# Altium project DIOT_temperature_logger.PrjPCB (part 2 of 6)

## Sheet MCU_STM32F4.SchDoc: Thermostat 8CH
size 420 x 297 mm; Author: G.K.; CompanyName: WUT; DrawnBy: G.K.; Organization: WUT ISE; Address1: Warsaw Univeristy of Technology; Address2: Nowowiejska 15/19; DocumentNumber: 3; Revision: -; SheetNumber: 3; SheetTotal: 8; EDA_Number: Sinara; Projet: Thermostat; ModifiedBy: -; CreateDate: XX/XX/XXXX; CheckedDate: -; Title2: STM32 CPU; DivGrp: ISE; Designer: G.K.; ModifiedDate: -; ProjectName: Booster RF Power Amplifier
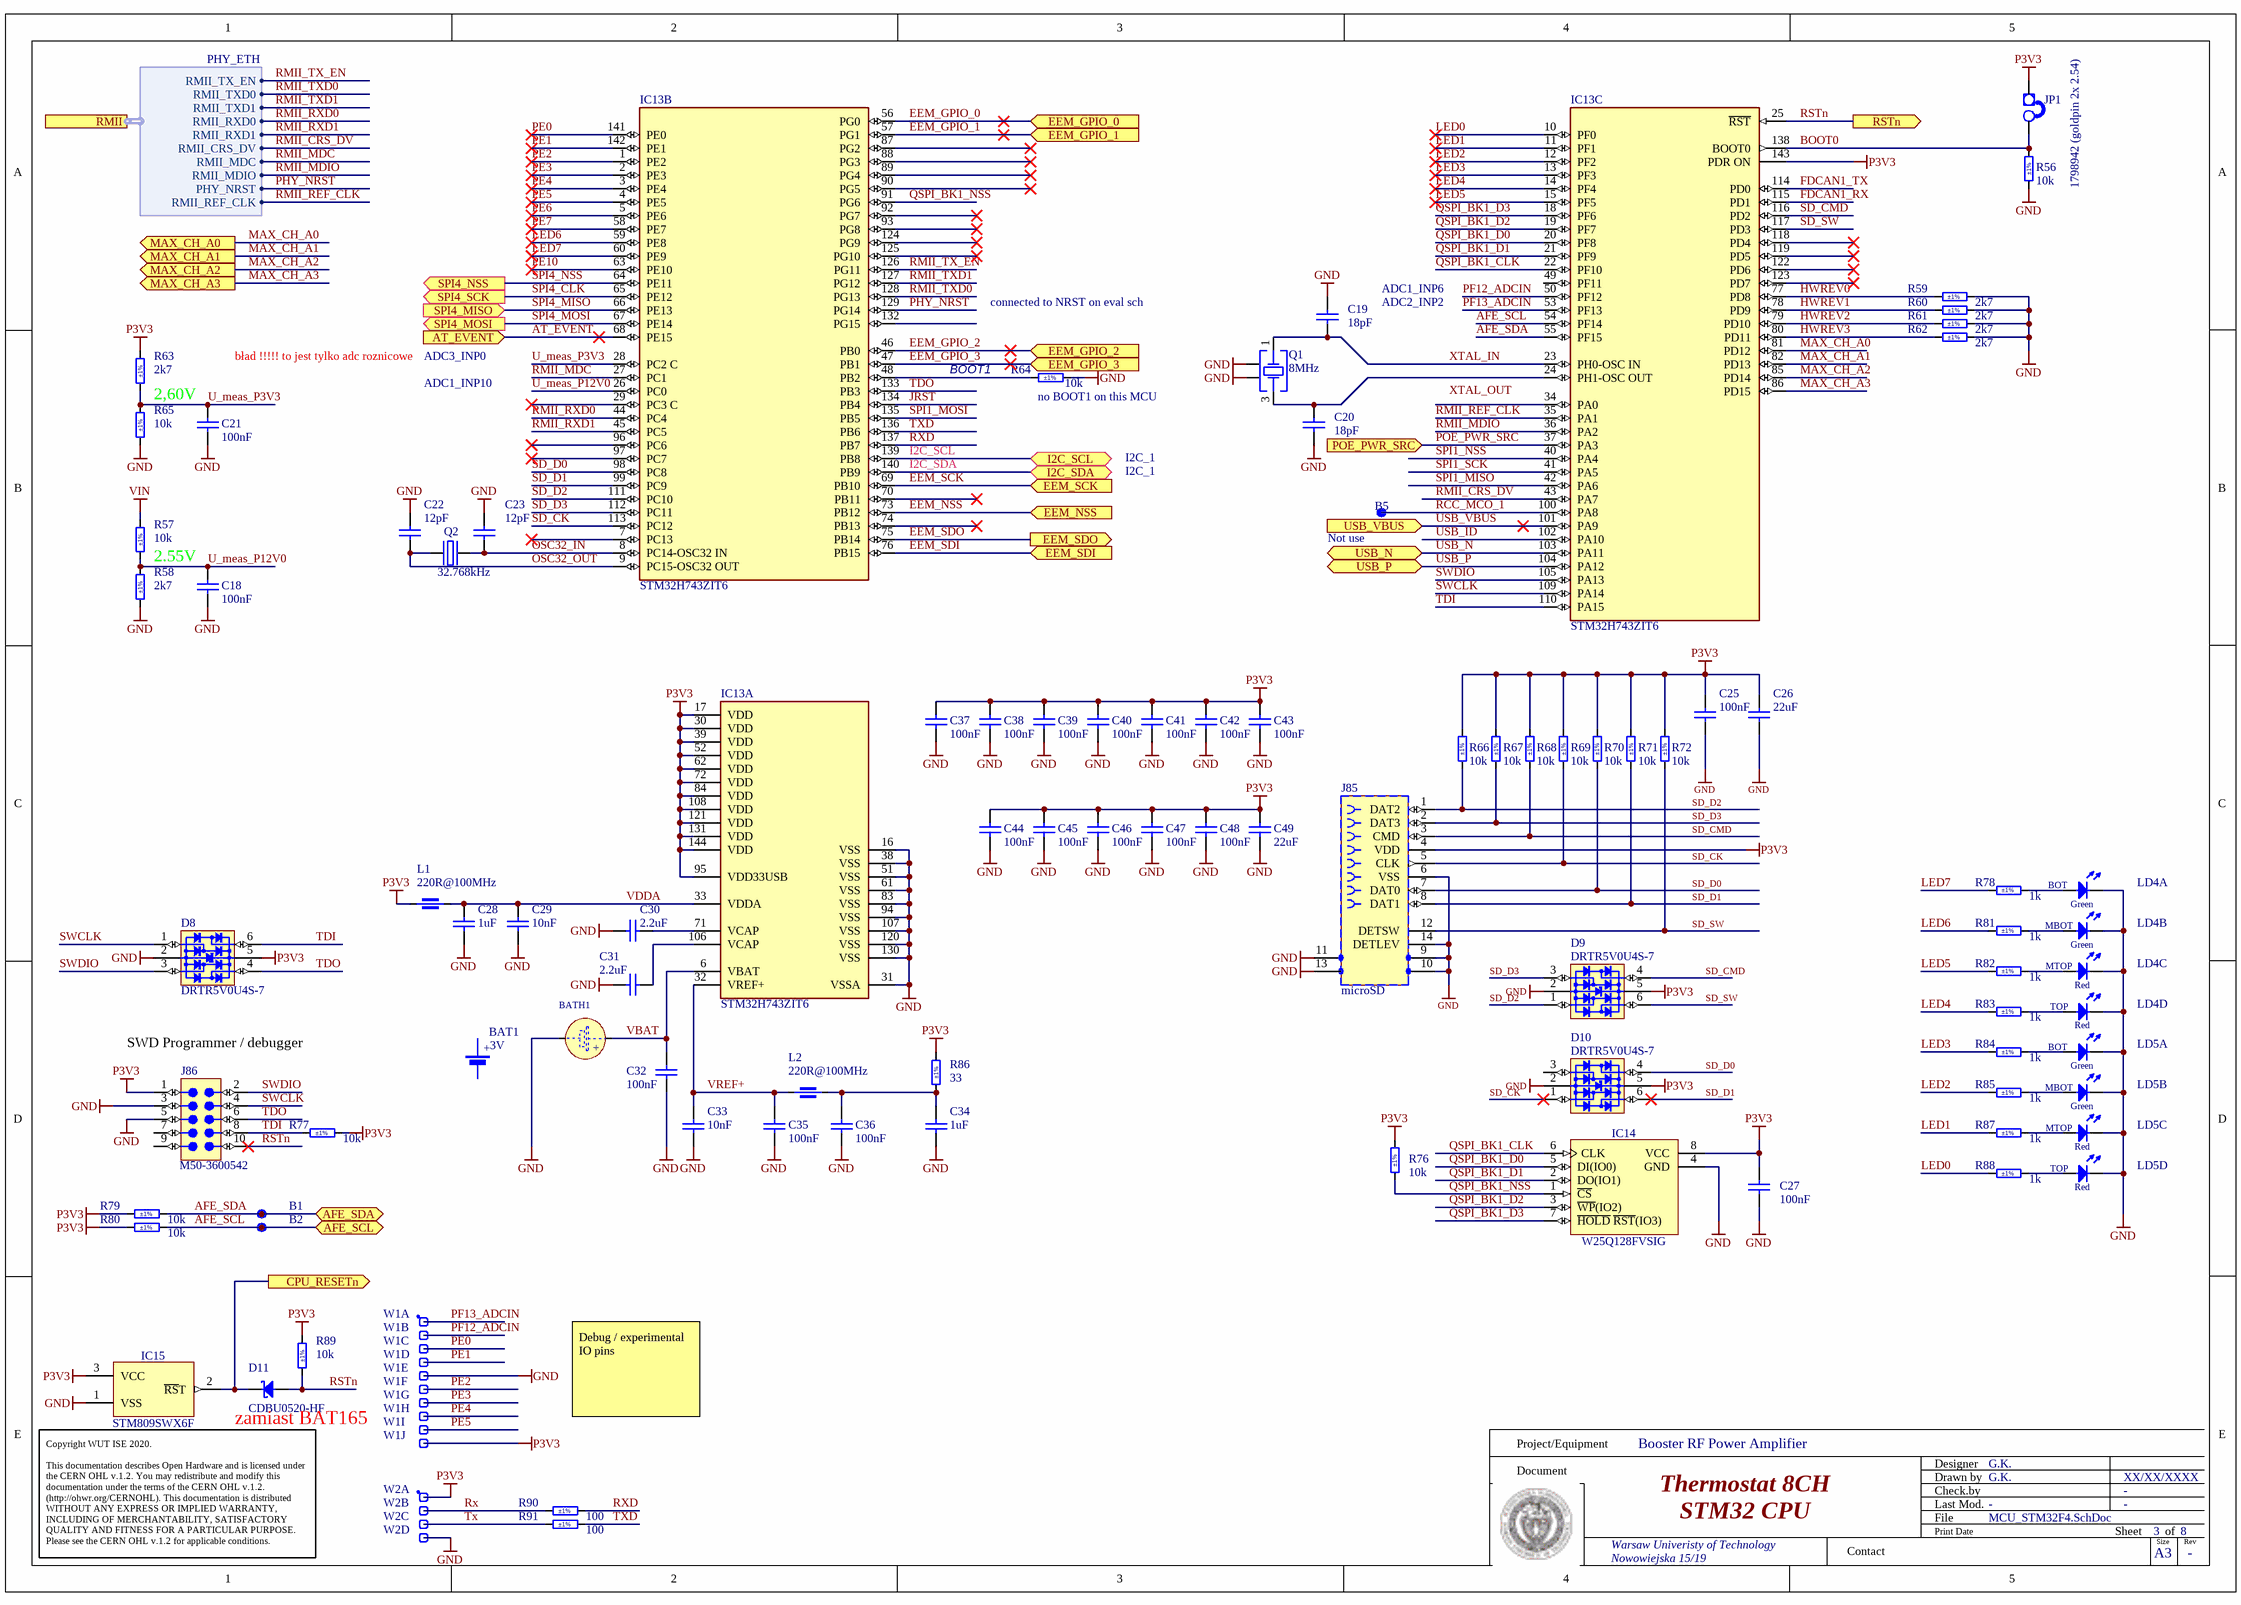
[diagram p1: MCU_STM32F4.SchDoc]

### Parts
B1  SMD Pad  [C100]  (value not drawn)  (no BOM)
B2  SMD Pad  [C100]  (value not drawn)  (no BOM)
B5  SMD Pad  [C100]  (value not drawn)  (no BOM)
BAT1  3V  [BAT_VARTA_CR1220]
BATH1  (no value)  [BATH_KEYSTONE_3000]
C18  100nF  [CAPC1608X87N]
C19  18pF  [CAPC1608X87N]
C20  18pF  [CAPC1608X87N]
C21  100nF  [CAPC1608X87N]
C22  12pF  [CAPC1608X87N]
C23  12pF  [CAPC1608X87N]
C25  100nF  [CAPC1608X87N]
C26  22uF  [CAPC2012X135N]
C27  100nF  [CAPC1608X87N]
C28  1uF  [CAPC1608X87N]
C29  10nF  [CAPC1608X87N]
C30  2.2uF  [CAPC1608X90N]
C31  2.2uF  [CAPC1608X90N]
C32  100nF  [CAPC1608X87N]
C33  10nF  [CAPC1608X87N]
C34  1uF  [CAPC1608X87N]
C35  100nF  [CAPC1608X87N]
C36  100nF  [CAPC1608X87N]
C37  100nF  [CAPC1608X87N]
C38  100nF  [CAPC1608X87N]
C39  100nF  [CAPC1608X87N]
C40  100nF  [CAPC1608X87N]
C41  100nF  [CAPC1608X87N]
C42  100nF  [CAPC1608X87N]
C43  100nF  [CAPC1608X87N]
C44  100nF  [CAPC1608X87N]
C45  100nF  [CAPC1608X87N]
C46  100nF  [CAPC1608X87N]
C47  100nF  [CAPC1608X87N]
C48  100nF  [CAPC1608X87N]
C49  22uF  [CAPC2012X135N]
D8  DRTR5V0U4S-7  [SOT65P210X110-6N]
D9  DRTR5V0U4S-7  [SOT65P210X110-6N]
D10  DRTR5V0U4S-7  [SOT65P210X110-6N]
D11  CDBU0520-HF  [SOD-523F]
IC13  STM32H743ZIT6  [FP-LQFP144-1A-MFG]  (parts A,B,C of 3)
IC14  W25Q128FVSIG  [SOIC127P790X216-8N]
IC15  STM809SWX6F  [SOT95P237X112-3N]
J85  microSD  [MOLEX_502570-0893]
J86  Manufacturer Part Number: M50-3600542  [HARWIN_M50-3600542]  (hidden comment: Header 10)
JP1  1798942 (goldpin 2x 2.54)  [jump]
L1  220R@100MHz  [INDC1608X95N]
L2  220R@100MHz  [INDC1608X95N]
LD4  Green/Green/HeRed/HeRed  [LED_BIVAR_H485CHHGGDL]  (value not drawn)  (parts A,B,C,D of 4)
LD5  Green/Green/HeRed/HeRed  [LED_BIVAR_H485CHHGGDL]  (value not drawn)  (parts A,B,C,D of 4)
Q1  8MHz  [WE-XTAL_CFPX-180]
Q2  32.768kHz  [XTAL_ABRACON_ABS06]
R56  10k  Tolerance: ±1%  [RESC1608X55N]
R57  10k  Tolerance: ±1%  [RESC1608X55N]
R58  2k7  Tolerance: ±1%  [RESC1608X55N]
R59  2k7  Tolerance: ±1%  [RESC1608X55N]
R60  2k7  Tolerance: ±1%  [RESC1608X55N]
R61  2k7  Tolerance: ±1%  [RESC1608X55N]
R62  2k7  Tolerance: ±1%  [RESC1608X55N]
R63  2k7  Tolerance: ±1%  [RESC1608X55N]
R64  10k  Tolerance: ±1%  [RESC1608X55N]
R65  10k  Tolerance: ±1%  [RESC1608X55N]
R66  10k  Tolerance: ±1%  [RESC1608X55N]
R67  10k  Tolerance: ±1%  [RESC1608X55N]
R68  10k  Tolerance: ±1%  [RESC1608X55N]
R69  10k  Tolerance: ±1%  [RESC1608X55N]
R70  10k  Tolerance: ±1%  [RESC1608X55N]
R71  10k  Tolerance: ±1%  [RESC1608X55N]
R72  10k  Tolerance: ±1%  [RESC1608X55N]
R76  10k  Tolerance: ±1%  [RESC1608X55N]
R77  10k  Tolerance: ±1%  [RESC1608X55N]
R78  1k  Tolerance: ±1%  [RESC1608X55N]
R79  10k  Tolerance: ±1%  [RESC1608X55N]
R80  10k  Tolerance: ±1%  [RESC1608X55N]
R81  1k  Tolerance: ±1%  [RESC1608X55N]
R82  1k  Tolerance: ±1%  [RESC1608X55N]
R83  1k  Tolerance: ±1%  [RESC1608X55N]
R84  1k  Tolerance: ±1%  [RESC1608X55N]
R85  1k  Tolerance: ±1%  [RESC1608X55N]
R86  33  Tolerance: ±1%  [RESC1608X55N]
R87  1k  Tolerance: ±1%  [RESC1608X55N]
R88  1k  Tolerance: ±1%  [RESC1608X55N]
R89  10k  Tolerance: ±1%  [RESC1608X55N]
R90  100  Tolerance: ±1%  [RESC1608X55N]
R91  100  Tolerance: ±1%  [RESC1608X55N]
W1  Header 10  [SAMTEC_MTLW-110-07-L-S-250]  (value not drawn)  (parts A,B,C,D,E,F,G,H,I,J of 10)
W2  Header 4  [SAMTEC_HTSW-104-23-L-S]  (value not drawn)  (parts A,B,C,D of 4)

### Ports
AFE_SCL (bidir), AFE_SDA (bidir), AT_EVENT (in), CPU_RESETn (out), EEM_GPIO_0 (in), EEM_GPIO_1 (in), EEM_GPIO_2 (in), EEM_GPIO_3 (in), EEM_NSS (in), EEM_SCK (in), EEM_SDI (in), EEM_SDO (out), I2C_SCL (bidir), I2C_SDA (bidir), MAX_CH_A0 (out), MAX_CH_A1 (out), MAX_CH_A2 (out), MAX_CH_A3 (out), POE_PWR_SRC (in), RMII (harness PHY_ETH), RSTn (out), SPI4_MISO (in), SPI4_MOSI (out), SPI4_NSS (out), SPI4_SCK (out), USB_N (bidir), USB_P (bidir), USB_VBUS (in)

### Harnesses
PHY_ETH: PHY_NRST, RMII_CRS_DV, RMII_MDC, RMII_MDIO, RMII_REF_CLK, RMII_RXD0, RMII_RXD1, RMII_TXD0, RMII_TXD1, RMII_TX_EN

### Nets
GND: BATH1.2(MINUS) C18.1 C19.1 C20.2 C21.1 C22.2 C23.2 C25.1 C26.1 C27.1 C28.1 C29.1 C30.1 C31.1 C32.1 C33.1 C34.1 C35.1 C36.1 C37.1 C38.1 C39.1 C40.1 C41.1 C42.1 C43.1 C44.1 C45.1 C46.1 C47.1 C48.1 C49.1 D8.2(GND) D9.2(GND) D10.2(GND) IC13.16(VSS) IC13.31(VSSA) IC13.38(VSS) IC13.51(VSS) IC13.61(VSS) IC13.83(VSS) IC13.94(VSS) IC13.107(VSS) IC13.120(VSS) IC13.130(VSS) IC14.4(GND) IC15.1(VSS) J85.6(VSS) J85.9 J85.10 J85.11 J85.13 J85.14(DETLEV) J86.3 J86.5 LD4.1(C) LD4.3(C) LD4.5(C) LD4.7(C) LD5.1(C) LD5.3(C) LD5.5(C) LD5.7(C) Q1.2(GND&Lid) Q1.4(GND&Lid) R56.1 R58.1 R59.2 R60.2 R61.2 R62.2 R64.2 R65.1 W1.5 W2.4
P3V3: C25.2 C26.2 C27.2 C37.2 C38.2 C39.2 C40.2 C41.2 C42.2 C43.2 C44.2 C45.2 C46.2 C47.2 C48.2 C49.2 D8.5(VBUS) D9.5(VBUS) D10.5(VBUS) IC13.17(VDD) IC13.30(VDD) IC13.39(VDD) IC13.52(VDD) IC13.62(VDD) IC13.72(VDD) IC13.84(VDD) IC13.95(VDD33USB) IC13.108(VDD) IC13.121(VDD) IC13.131(VDD) IC13.143(PDR_ON) IC13.144(VDD) IC14.8(VCC) IC15.3(VCC) J85.4(VDD) J86.1 JP1.1(E1) L1.1 R63.2 R66.2 R67.2 R68.2 R69.2 R70.2 R71.2 R72.2 R76.2 R77.2 R79.1 R80.1 R86.2 R89.2 W1.10 W2.1
VIN: R57.2
AFE_SCL: B2.1 IC13.54(PF14) R80.2 ; port AFE_SCL
AFE_SDA: B1.1 IC13.55(PF15) R79.2 ; port AFE_SDA
AT_EVENT: IC13.68(PE15) ; port AT_EVENT
BOOT0: IC13.138(BOOT0) JP1.2(E2) R56.2
CPU_RESETn: D11.1(C) IC15.2(~{RS}T) ; port CPU_RESETn
EEM_GPIO_0: IC13.56(PG0) ; port EEM_GPIO_0
EEM_GPIO_1: IC13.57(PG1) ; port EEM_GPIO_1
EEM_GPIO_2: IC13.46(PB0) ; port EEM_GPIO_2
EEM_GPIO_3: IC13.47(PB1) ; port EEM_GPIO_3
EEM_NSS: IC13.73(PB12) ; port EEM_NSS  [project net CSN]
EEM_SCK: IC13.69(PB10) ; port EEM_SCK
EEM_SDI: IC13.76(PB15) ; port EEM_SDI
EEM_SDO: IC13.75(PB14) ; port EEM_SDO
FDCAN1_RX: IC13.115(PD1)
FDCAN1_TX: IC13.114(PD0)
HWREV0: IC13.77(PD8) R59.1
HWREV1: IC13.78(PD9) R60.1
HWREV2: IC13.79(PD10) R61.1
HWREV3: IC13.80(PD11) R62.1
I2C_SCL: IC13.139(PB8) ; port I2C_SCL
I2C_SDA: IC13.140(PB9) ; port I2C_SDA
JRST: IC13.134(PB4)
LED0: IC13.10(PF0) R88.1
LED1: IC13.11(PF1) R87.1
LED2: IC13.12(PF2) R85.1
LED3: IC13.13(PF3) R84.1
LED4: IC13.14(PF4) R83.1
LED5: IC13.15(PF5) R82.1
LED6: IC13.59(PE8) R81.1
LED7: IC13.60(PE9) R78.1
MAX_CH_A0: IC13.81(PD12) ; port MAX_CH_A0
MAX_CH_A1: IC13.82(PD13) ; port MAX_CH_A1
MAX_CH_A2: IC13.85(PD14) ; port MAX_CH_A2
MAX_CH_A3: IC13.86(PD15) ; port MAX_CH_A3
OSC32_IN: C23.1 IC13.8(PC14-OSC32_IN) Q2.2(OSC2)
OSC32_OUT: C22.1 IC13.9(PC15-OSC32_OUT) Q2.1(OSC1)
PE0: IC13.141(PE0) W1.3
PE1: IC13.142(PE1) W1.4
PE2: IC13.1(PE2) W1.6
PE3: IC13.2(PE3) W1.7
PE4: IC13.3(PE4) W1.8
PE5: IC13.4(PE5) W1.9
PE6: IC13.5(PE6)
PE7: IC13.58(PE7)
PE10: IC13.63(PE10)
PF12_ADCIN: IC13.50(PF12) W1.2
PF13_ADCIN: IC13.53(PF13) W1.1
PHY_NRST: IC13.129(PG14) ; port RMII.PHY_NRST
POE_PWR_SRC: IC13.37(PA3) ; port POE_PWR_SRC
QSPI_BK1_CLK: IC13.22(PF10) IC14.6(CLK)
QSPI_BK1_D0: IC13.20(PF8) IC14.5(DI(IO0))
QSPI_BK1_D1: IC13.21(PF9) IC14.2(DO(IO1))
QSPI_BK1_D2: IC13.19(PF7) IC14.3(~{WP}(IO2))
QSPI_BK1_D3: IC13.18(PF6) IC14.7(~{HOLD}_~{RST}(IO3))
QSPI_BK1_NSS: IC13.91(PG6) IC14.1(~{CS}) R76.1
RCC_MCO_1: B5.1 IC13.100(PA8)
RMII_CRS_DV: IC13.43(PA7) ; port RMII.RMII_CRS_DV
RMII_MDC: IC13.27(PC1) ; port RMII.RMII_MDC
RMII_MDIO: IC13.36(PA2) ; port RMII.RMII_MDIO
RMII_REF_CLK: IC13.35(PA1) ; port RMII.RMII_REF_CLK
RMII_RXD0: IC13.44(PC4) ; port RMII.RMII_RXD0
RMII_RXD1: IC13.45(PC5) ; port RMII.RMII_RXD1
RMII_TX_EN: IC13.126(PG11) ; port RMII.RMII_TX_EN
RMII_TXD0: IC13.128(PG13) ; port RMII.RMII_TXD0
RMII_TXD1: IC13.127(PG12) ; port RMII.RMII_TXD1
RSTn: D11.2(A) IC13.25(~{RST}) J86.10 R89.1 ; port RSTn
Rx: R90.2 W2.2
RXD: IC13.137(PB7) R90.1
SD_CK: D10.1(I/O1) IC13.113(PC12) J85.5(CLK) R69.1
SD_CMD: D9.4(I/O3) IC13.116(PD2) J85.3(CMD) R68.1
SD_D0: D10.4(I/O3) IC13.98(PC8) J85.7(DAT0) R70.1
SD_D1: D10.6(I/O4) IC13.99(PC9) J85.8(DAT1) R71.1
SD_D2: D9.1(I/O1) IC13.111(PC10) J85.1(DAT2) R66.1
SD_D3: D9.3(I/O2) IC13.112(PC11) J85.2(DAT3) R67.1
SD_SW: D9.6(I/O4) IC13.117(PD3) J85.12(DETSW) R72.1
SPI1_MISO: IC13.42(PA6)
SPI1_MOSI: IC13.135(PB5)
SPI1_NSS: IC13.40(PA4)
SPI1_SCK: IC13.41(PA5)
SPI4_CLK: IC13.65(PE12) ; port SPI4_SCK
SPI4_MISO: IC13.66(PE13) ; port SPI4_MISO
SPI4_MOSI: IC13.67(PE14) ; port SPI4_MOSI
SPI4_NSS: IC13.64(PE11) ; port SPI4_NSS
SWCLK: D8.1(I/O1) IC13.109(PA14) J86.4
SWDIO: D8.3(I/O2) IC13.105(PA13) J86.2
TDI: D8.6(I/O4) IC13.110(PA15) J86.8 R77.1
TDO: D8.4(I/O3) IC13.133(PB3) J86.6
Tx: R91.2 W2.3
TXD: IC13.136(PB6) R91.1
U_meas_P3V3: C21.2 IC13.28(PC2_C) R63.1 R65.2
U_meas_P12V0: C18.2 IC13.26(PC0) R57.1 R58.2
USB_ID: IC13.102(PA10)
USB_N: IC13.103(PA11) ; port USB_N
USB_P: IC13.104(PA12) ; port USB_P
USB_VBUS: IC13.101(PA9) ; port USB_VBUS
VBAT: BATH1.1(PLUS) C32.2 IC13.6(VBAT)
VDDA: C28.2 C29.2 IC13.33(VDDA) L1.2
VREF+: C33.2 C35.2 IC13.32(VREF+) L2.1
XTAL_IN: C19.2 IC13.23(PH0-OSC_IN) Q1.1(Crystal)
NetC20_1: C20.1 IC13.24(PH1-OSC_OUT) Q1.3(Crystal)
NetC30_2: C30.2 IC13.71(VCAP)
NetC31_2: C31.2 IC13.106(VCAP)
NetC34_2: C34.2 C36.2 L2.2 R86.1
NetIC13_48: IC13.48(PB2) R64.1
NetLD4_2: LD4.2(A) R78.2
NetLD4_4: LD4.4(A) R81.2
NetLD4_6: LD4.6(A) R82.2
NetLD4_8: LD4.8(A) R83.2
NetLD5_2: LD5.2(A) R84.2
NetLD5_4: LD5.4(A) R85.2
NetLD5_6: LD5.6(A) R87.2
NetLD5_8: LD5.8(A) R88.2

Not connected (* = marked no-connect by the designer): D10 3(I/O2); IC13 7(PC13)* 29(PC3_C)* 34(PA0) 49(PF11) 70(PB11)* 74(PB13)* 87(PG2)* 88(PG3)* 89(PG4)* 90(PG5)* 92(PG7)* 93(PG8)* 96(PC6)* 97(PC7)* 118(PD4)* 119(PD5)* 122(PD6)* 123(PD7)* 124(PG9)* 125(PG10)* 132(PG15); J86 7 9

### Notes on the sheet
- connected to NRST on eval sch
- ADC1_INP6
- ADC2_INP2
- 2,60V
- bład !!!!! to jest tylko adc roznicowe
- ADC3_INP0
- ADC1_INP10
- (near IC13) BOOT1
- (near R64) no BOOT1 on this MCU
- I2C_1
- (near B5) Not use
- 2.55V
- SWD Programmer / debugger
- Debug / experimental IO pins
- (near D11) zamiast BAT165
- Labels drawn without touching a wire or pin: XTAL_OUT
- Project/Equipment
- Document
- Designer
- Drawn by
- Check.by
- Copyright WUT ISE 2020.
  This documentation describes Open Hardware and is licensed under the CERN OHL v.1.2. You may redistribute and modify this documentation under the terms of the CERN OHL v.1.2. (http://ohwr.org/CERNOHL). This documentation is distributed WITHOUT ANY EXPRESS OR IMPLIED WARRANTY, INCLUDING OF MERCHANTABILITY, SATISFACTORY QUALITY AND FITNESS FOR A PARTICULAR PURPOSE. Please see the CERN OHL v.1.2 for applicable conditions.
- Contact
- File
- Last Mod.
- Print Date
- Sheet
- Size
- A3
- of
- Rev
- (in symbol BAT_VARTA_CR1220) +
- (in symbol BATH_KEYSTONE_3000) +
- (in symbol LED_BIVAR_H485CHHGGDL, part A) BOT; Green
- (in symbol LED_BIVAR_H485CHHGGDL, part B) MBOT; Green
- (in symbol LED_BIVAR_H485CHHGGDL, part C) MTOP; Red
- (in symbol LED_BIVAR_H485CHHGGDL, part D) TOP; Red

### Library data of the parts
B1 B2 = SMD_PAD_D1MM: Pad; Part Description: 1mm Diameter SMD Pad; Mounted: No; Part Number: SMD_PAD_D1MM; Component Type: Standard (No BOM); Pin Count: 1; Family: SMD Pad; Socket: No; SMD: Yes; Sense: No; Status: None; ComponentHeight: 0mm; HelpURL: Undefined; Author: CERN DEM JLC; CreateDate: 10.10.2017; LatestRevisionDate: 10.10.2017; PackageDescription: 1mm Diameter SMD Pad
B5 = SMD_PAD_D1MM: Through Hole Pad; Part Description: 1mm Diameter SMD Pad; Mounted: No; Part Number: SMD_PAD_D1MM; Component Type: Standard (No BOM); Pin Count: 1; Family: SMD Pad; Socket: No; SMD: No; Sense: No; Status: None; ComponentHeight: 0mm; HelpURL: Undefined; Author: CERN DEM JLC; CreateDate: 10.10.2017; LatestRevisionDate: 10.10.2017; PackageDescription: 1mm Diameter SMD Pad
BAT1 = BAT_VARTA_CR1220: Battery for use only with Socket Holder; Part Description: CR1210, 12.5mm Diameter x 2mm  Height Lithium Coin Cells; Manufacturer: VARTA; Manufacturer Part Number: 6220; PressFit: No; Power: 35mAh; Part Number: BAT_VARTA_CR1220; Component Kind: Accessories; Component Type: Standard; Pin Count: 0; PackageDescription: CR1210, 12.5mm Diameter x 2mm  Height Lithium Coin Cells; Family: Battery; Mounted: Yes; Socket: Yes; SMD: No; Sense: No; Value: 3V; ComponentHeight: 2mm; HelpURL: \\cern.ch\dfs\Applications\Altium\Datasheets\BAT_VARTA_CR1220.pdf; Author: CERN DEM JLC; CreateDate: 17.04.2012; LatestRevisionDate: 17.04.2012
BATH1 = BATH_KEYSTONE_3000: Battery Holder whit 2 Pin; Part Description: SMD Battery Holder for CR1216, BR1220, CL1225, SR1120, D381, 391, 191 Coin Cells; Manufacturer Part Number: 3000; PressFit: No; Part Number: BATH_KEYSTONE_3000; Component Kind: Standard; Component Type: Standard; Pin Count: 3; PackageDescription: SMD Battery Holder for CR1216, BR1220, CL1225, SR1120, D381, 391, 191 Coin Cells; Family: Battery; Mounted: Yes; Socket: No; SMD: Yes; Sense: No; Manufacturer: KEYSTONE; ComponentHeight: 3.17mm; HelpURL: \\cern.ch\dfs\Applications\Altium\Datasheets\BATH_KEYSTONE_3000.pdf; Author: CERN DEM JLC; CreateDate: 17.04.2012; LatestRevisionDate: 07.06.2017
C18 C21 C25 C27 C32 C35-C48 = CC0603_100NF_50V_10%_X7R: as C70 on sheet Thermostat_16CH; Part Number: CC0603_100NF_50V_10%_X7R; Component Kind: Standard; Component Type: Standard; Pin Count: 2; Value: 100nF; Status: Preferred; Manufacturer Part Number: CC0603_100NF_50V_10%_X7R; Case: 0603; Mounted: Yes; Socket: No; SMD: Yes; Sense: No; Manufacturer1 Example: PHYCOMP; Manufacturer1 ComponentHeight: 0.87mm; HelpURL: \\cern.ch\dfs\Applications\Altium\Datasheets\CC0603_X7R_PHYCOMP.pdf; Author: CERN DEM JLC; CreateDate: 03.12.2007; LatestRevisionDate: 03.12.2007
C19 C20 = CC0603_18PF_50V_5%_NP0: Non-polarised capacitor; Part Description: SMD Multilayer Chip Ceramic Capacitor; Manufacturer: GENERIC; Manufacturer1 Part Number: 223886715189; Voltage: 50V; TC: C0G/NP0; Tolerance: ±5%; Part Number: CC0603_18PF_50V_5%_NP0; Component Kind: Standard; Component Type: Standard; Pin Count: 2; Value: 18pF; Status: Preferred; Manufacturer Part Number: CC0603_18PF_50V_5%_NP0; Case: 0603; Mounted: Yes; Socket: No; SMD: Yes; Sense: No; Manufacturer1 Example: PHYCOMP; Manufacturer1 ComponentHeight: 0.87mm; HelpURL: \\cern.ch\dfs\Applications\Altium\Datasheets\CC0603_NP0_PHYCOMP.pdf; Author: CERN DEM JLC; CreateDate: 03.12.2007; LatestRevisionDate: 03.12.2007
C22 C23 = CC0603_12PF_50V_5%_NP0: Non-polarised capacitor; Part Description: SMD Multilayer Chip Ceramic Capacitor; Manufacturer: GENERIC; Manufacturer1 Part Number: 223886715129; Voltage: 50V; TC: C0G/NP0; Tolerance: ±5%; Part Number: CC0603_12PF_50V_5%_NP0; Component Kind: Standard; Component Type: Standard; Pin Count: 2; Value: 12pF; Status: Preferred; Manufacturer Part Number: CC0603_12PF_50V_5%_NP0; Case: 0603; Mounted: Yes; Socket: No; SMD: Yes; Sense: No; Manufacturer1 Example: PHYCOMP; Manufacturer1 ComponentHeight: 0.87mm; HelpURL: \\cern.ch\dfs\Applications\Altium\Datasheets\CC0603_NP0_PHYCOMP.pdf; Author: CERN DEM JLC; CreateDate: 03.12.2007; LatestRevisionDate: 03.12.2007
C26 C49 = CC0805_22UF_16V_10%_X5R: Non-polarised capacitor; Part Description: SMD Multilayer Chip Ceramic Capacitor; Manufacturer: GENERIC; Manufacturer1 Part Number: C2012X5R1C226KT; Voltage: 16V; TC: X5R; Tolerance: ±10%; Part Number: CC0805_22UF_16V_10%_X5R; Component Kind: Standard; Component Type: Standard; Pin Count: 2; Value: 22uF; Status: Preferred; Manufacturer Part Number: CC0805_22UF_16V_10%_X5R; Case: 0805; Mounted: Yes; Socket: No; SMD: Yes; Sense: No; Manufacturer1 Example: TDK; Manufacturer1 ComponentHeight: 1.35mm; HelpURL: \\cern.ch\dfs\Applications\Altium\Datasheets\CC0805_X5R_TDK_C.pdf; Author: CERN DEM JLC; CreateDate: 25.10.2012; LatestRevisionDate: 25.10.2012
C28 C34 = CC0603_1UF_16V_10%_X7R: Non-polarised capacitor; Part Description: SMD Multilayer Chip Ceramic Capacitor; Manufacturer: GENERIC; Manufacturer1 Part Number: 223878615663; Voltage: 16V; TC: X7R; Tolerance: ±10%; Part Number: CC0603_1UF_16V_10%_X7R; Component Kind: Standard; Component Type: Standard; Pin Count: 2; Value: 1uF; Status: None; Manufacturer Part Number: CC0603_1UF_16V_10%_X7R; Case: 0603; Mounted: Yes; Socket: No; SMD: Yes; Sense: No; Manufacturer1 Example: YAGEO PHYCOMP; Manufacturer1 ComponentHeight: 0.9mm; HelpURL: \\cern.ch\dfs\Applications\Altium\Datasheets\CC0603_X7R_PHYCOMP.pdf; Author: CERN DEM JLC; CreateDate: 03.12.2007; LatestRevisionDate: 17.04.2015
C29 C33 = CC0603_10NF_50V_10%_X7R: Non-polarised capacitor; Part Description: SMD Multilayer Chip Ceramic Capacitor; Manufacturer: GENERIC; Manufacturer1 Part Number: 223858615636; Voltage: 50V; TC: X7R; Tolerance: ±10%; Part Number: CC0603_10NF_50V_10%_X7R; Component Kind: Standard; Component Type: Standard; Pin Count: 2; Value: 10nF; Status: Preferred; Manufacturer Part Number: CC0603_10NF_50V_10%_X7R; Case: 0603; Mounted: Yes; Socket: No; SMD: Yes; Sense: No; Manufacturer1 Example: PHYCOMP; Manufacturer1 ComponentHeight: 0.87mm; HelpURL: \\cern.ch\dfs\Applications\Altium\Datasheets\CC0603_X7R_PHYCOMP.pdf; Author: CERN DEM JLC; CreateDate: 03.12.2007; LatestRevisionDate: 03.12.2007
C30 C31 = CC0603_2.2UF_10V_20%_X7R: Non-polarised capacitor; Part Description: SMD Multilayer Chip Ceramic Capacitor; Manufacturer: GENERIC; Manufacturer1 Part Number: LMK107B7225MA-T; Voltage: 10V; TC: X7R; Tolerance: ±20%; Part Number: CC0603_2.2UF_10V_20%_X7R; Component Kind: Standard; Component Type: Standard; Pin Count: 2; Value: 2.2uF; Status: Not Recommended; Manufacturer Part Number: CC0603_2.2UF_10V_20%_X7R; Case: 0603; Mounted: Yes; Socket: No; SMD: Yes; Sense: No; Manufacturer1 Example: TAIYO YUDEN; Manufacturer1 ComponentHeight: 0.9mm; HelpURL: \\cern.ch\dfs\Applications\Altium\Datasheets\CC0603_X7R_TAIYO-YUDEN_HIGH-VALUE.pdf; Author: CERN DEM JLC; CreateDate: 22.06.2011; LatestRevisionDate: 27.06.2011
D8-D10 = D_TVS_DRTR5V0U4S-7: as D21 on sheet Thermostat_16CH; Part Number: DRTR5V0U4S-7; Component Kind: Standard; Component Type: Standard; Device: DRTR5V0U4S-7; PackageDescription: SOT363, SC70-6, 0.65mm Pitch; 6 Pin, 1.25mm W X 2.00mm L X 1.10mm H body, IPC Medium Density; Status: Active; Manufacturer Part Number: DRTR5V0U4S-7; Pin Count: 6; Case: SOT363; Mounted: Yes; Socket: No; SMD: Yes; Sense: No; ComponentHeight: 1.1mm; HelpURL: \\cern.ch\dfs\Applications\Altium\Datasheets\PRTR5V0U4Y.pdf; Author: GK; CreateDate: 24.01.2017; LatestRevisionDate: 14.09.2020
D11 = CDBU0520-HF: Schottky Diode; Part Description: 20V Surface mount Schottky Barrier Diode; Manufacturer: COMCHIP; Voltage: 20V; Power: 500mA; PressFit: No; Bonding: No; Part Number: CDBU0520-HF; Component Kind: Standard; Component Type: Standard; Device: CDBU0520-HF; PackageDescription: Small Outline Diode Flat Lead (SOD-523F), Body; 1.80mm L X 1mm W X 0.85mm H; Manufacturer Part Number: CDBU0520-HF; Pin Count: 2; Case: SOD-523F; Mounted: Yes; Socket: No; SMD: Yes; Sense: No; ComponentHeight: 1mm; HelpURL: \\cern.ch\dfs\Applications\Altium\Datasheets\CDBU0520-HF.pdf; Author: CERN DEM HF; CreateDate: 13.10.2023; LatestRevisionDate: 13.10.2023
IC13 = CMP-12105-000003-1: IC MCU 32BIT 2MB FLASH 144LQFP; Manufacturer: STMicroelectronics; Number Of I2C Channels: 4; Number Of A/D Converters: 2; Standoff Height: 0.05mm; Interface: I2C,SPI,UART,USART,EBI/EMI,CAN,USB,LIN,IrDA,Other; Max Supply Voltage: 3.6V; Number Of Adc Channels: 36; Ram Size: 1MBytes; Number Of Cores: 1; Frequency: 400MHz; Data Bus Width: 32bits; Core Architecture: ARM Cortex-M7; Memory Size: 2MBytes; Number Of Timers/Counters: 22; Min Supply Voltage: 1.62V; Number Of Spi Channels: 6; Max Junction Temp: +125°C; Number Of I/Os: 114; Digikey Description: IC MCU 32BIT 2MB FLASH 144LQFP; Device Class L2: Embedded Processors and Controllers; Number Of Usb Channels: 2; ComponentLink2Description: Datasheet; Ipc Land Pattern Name: QFP50P2200X2200X160-144; Category: IC; Lead Free: Yes; Temperature Range High: +85°C; Mouser Description: MCU 32-Bit STM32 ARM Cortex M7 RISC 2MB Flash 1.8V/2.5V/3.3V 144-Pin LQFP Tray; RoHS: TRUE; Ambient Temperature Range Low: -40°C; Temperature Range Low: -40°C; ComponentLink2URL: https://www.st.com/resource/en/datasheet/stm32h743zi.pdf; Ambient Temperature Range High: +85°C; Octopart: https://octopart.com/stm32h743zit6-stmicroelectronics-76372529; Number Of Pwm Channels: 2; Height: 1.6mm; Manufacturer Part Number: STM32H743ZIT6; Device Class L3: Microcontrollers; Device Class L1: Integrated Circuits (ICs); Automotive: No; Memory Type: FLASH; Number Of Uart Channels: 4; Package: LQFP144-1A; Temperature: -40°C to +85°C
IC14 = W25Q128FVSIG: 128M-bit Serial Flash Memory with uniform 4KB sectors and Dual/Quad SPI and QPI; Manufacturer: WINBOND; PressFit: No; Bonding: No; Part Number: W25Q128FVSIG; Component Kind: Standard; Component Type: Standard; Device: W25Q128FVSIG; PackageDescription: SOIC, 1.27mm Pitch; 8 Pin, 5.285mm W X 5.335mm L X 2.16mm H body, IPC Medium Density; Part Description: 128M-bit Serial Flash Memory with uniform 4KB sectors and Dual/Quad SPI and QPI; Manufacturer Part Number: W25Q128FVSIG; Pin Count: 8; Case: SOIC8; Mounted: Yes; Socket: No; SMD: Yes; Sense: No; ComponentHeight: 2.16mm; HelpURL: \\cern.ch\dfs\Applications\Altium\Datasheets\W25Q128FVSIG.pdf; Author: CERN DEM MR; CreateDate: 26.01.2018; LatestRevisionDate: 26.01.2018
IC15 = STM809SWX6F: 3-Pin Microprocessor Reset Circuit; Part Description: 3-Pin Microprocessor Reset Circuit, Reset Threshold Voltage 2.85-3.00V; Manufacturer: ST MICROELECTRONICS; PressFit: No; Bonding: No; Part Number: STM809SWX6F; Component Kind: Standard; Component Type: Standard; Device: STM809SWX6F; PackageDescription: SOT, 0.95mm, pitch; 3 pin,1.30mm W X 2.92mm L X 1.12mm H body, IPC Medium Density; Manufacturer Part Number: STM809SWX6F; Pin Count: 3; Case: SOT23; Mounted: Yes; Socket: No; SMD: Yes; Sense: No; ComponentHeight: 1.12mm; HelpURL: \\cern.ch\dfs\Applications\Altium\Datasheets\STM809SWX6F.pdf; Author: CERN DEM JMW; CreateDate: 11.08.2015; LatestRevisionDate: 11.08.2015
J85 = MOLEX_502570-0893: Connector MicroSD 8 Pin; Part Description: 1.10mm Pitch, Surface Mount, Normal Mount MicroSD Memory Card Connector; Manufacturer: MOLEX; PressFit: No; Part Number: MOLEX_502570-0893; Component Kind: Standard; Component Type: Standard; Pin Count: 12; Family: microSD; Mounted: Yes; Socket: No; SMD: Yes; Sense: No; Status: None; Manufacturer Part Number: 502570-0893; ComponentHeight: 2.03mm; HelpURL: \\cern.ch\dfs\Applications\Altium\Datasheets\MOLEX_502570-0893.pdf; Author: CERN DEM JLC; CreateDate: 22.01.2015; LatestRevisionDate: 22.01.2015
J86 = CON_2x10 1.27 SMT_male_HARWIN: 10 Contacts - Pitch 1.27mm - Dual Row SMT Vertical Pin Header (Post Lead = 3mm, Insulator 1mm); Manufacturer: HARWIN; PressFit: No; Part Number: HARWIN_M50-3600542; Component Kind: Standard; Component Type: Standard; Pin Count: 10; Family: Header 10; Mounted: Yes; Socket: No; SMD: Yes; Sense: No; Status: None; Part Description: 10 Contacts - Pitch 1.27mm - Dual Row SMT Vertical Pin Header (Post Lead = 3mm, Insulator 1mm); ComponentHeight: 5.13mm; HelpURL: \\cern.ch\dfs\Applications\Altium\Datasheets\HARWIN_M50-3600842.pdf; Author: GK; CreateDate: 15.03.2017; LatestRevisionDate: 22.05.2017
JP1 = JUMPER: Supplier 1: Farnell; Supplier Part Number 1: 1798942
L1 L2 = IND0603_MURATA_BLM18SG221TN1: Part Description: SMD EMIFIL Suppression Chip Ferrite Bead; Manufacturer: MURATA; Power: 2.5A; Resistance: 0.04R; Tolerance: ±25%; Part Number: IND0603_MURATA_BLM18SG221TN1; Component Kind: Standard; Component Type: Standard; Pin Count: 2; Value: 220R@100MHz; Manufacturer Part Number: BLM18SG221TN1; Case: 0603; Mounted: Yes; Socket: No; SMD: Yes; Sense: No; ComponentHeight: 0.95mm; HelpURL: \\cern.ch\dfs\Applications\Altium\Datasheets\IND0603_MURATA_BLM18S.pdf; Author: CERN DEM MR; CreateDate: 08.01.2016; LatestRevisionDate: 25.10.2018
LD4 LD5 = LED_BIVAR_H485CHHGGDL: LED x4 G-1C2A-BOT_G-3C4A_H-5C6A_H-7C8A-TOP; Part Description: Quad-Level 2mm (Green+Green+HeRed+HeRed) LED, PCB Edge Mounting; Manufacturer: BIVAR; PressFit: No; Bonding: No; Part Number: LED_BIVAR_H485CHHGGDL; Component Kind: Standard; Component Type: Standard; Color: Green/Green/HeRed/HeRed; PackageDescription: Quad-Level 2mm (Green+Green+HeRed+HeRed) LED, PCB Edge Mounting  BIVAR H485C Serie; Status: Not Recommended; Manufacturer Part Number: H485CHHGGDL; Pin Count: 8; Mounted: Yes; Socket: No; SMD: No; Sense: No; ComponentHeight: 11.3mm; HelpURL: \\cern.ch\dfs\Applications\Altium\Datasheets\LED_BIVAR_H485C.pdf; Author: CERN DEM BC; CreateDate: 12.11.2015; LatestRevisionDate: 12.11.2015
Q1 = 830108313809: WE-XTAL Quartz Crystal, SMT, CFPX-180, 8MHz, +/-30ppm; Manufacturer: Wurth Elektronik; Frequency Stability: +/-50ppm; Load Capacitance: 12pF; ComponentLink1Description: Website Link; ComponentLink1URL: https://www.we-online.com/redexpert/article/830108313809?ad; ComponentLink2Description: Datasheet Link; ComponentLink2URL: https://www.we-online.com/redexpert/spec/830108313809?ad; Manufacturer Part Number: 830108313809; Category: Crystals; Match Code: WE-XTAL; Mount: Surface Mount; Operating Temperature Max: 85°C; Operating Temperature Min: -40°C; Packaging: Tape and Reel; Case/Size Code: CFPX-180; Length: 3.4mm; Width: 2.7mm; Height: 0.8mm; Frequency: 8MHz; Frequency Tolerance: +/-30ppm
Q2 = XTAL_32.768KHZ_ABRACON_ABS06-32.768KHZ-9: Quartz Crystal; Part Description: Tolerance: ±20ppm, -40°C to +85°C, 9pF, SMD Low Profile Crystal, ABS06 Series; PressFit: No; Bonding: No; Part Number: XTAL_32.768KHZ_ABRACON_ABS06-32.768KHZ-9; Component Kind: Standard; Component Type: Standard; PackageDescription: 2 Pins, 2.15x1.3mm, SMD Low Profile Crystal, ABS06 Series; Value: 32.768kHz; Manufacturer: ABRACON; Manufacturer Part Number: ABS06-32.768kHz-9; Pin Count: 2; Mounted: Yes; Socket: No; SMD: Yes; Sense: No; ComponentHeight: 0.6mm; HelpURL: \\cern.ch\dfs\Applications\Altium\Datasheets\XTAL_ABRACON_ABS06.pdf; Author: CERN DEM JMW; CreateDate: 12.08.2015; LatestRevisionDate: 12.08.2015
R56 R57 R64-R72 R76 R77 R79 R80 R89 = R0603_10K_1%_0.1W_100PPM: Resistor - 1%; Part Description: General Purpose Thick Film Chip Resistor; Manufacturer: GENERIC; Manufacturer1 Part Number: NRC06F1002TRF; Power: 0.1W; TC: ±100ppm/°C; PressFit: No; Part Number: R0603_10K_1%_0.1W_100PPM; Component Kind: Standard; Component Type: Standard; Pin Count: 2; Value: 10k; Status: Preferred; Manufacturer Part Number: R0603_10K_1%_0.1W_100PPM; Case: 0603; Mounted: Yes; Sense: No; Socket: No; SMD: Yes; Manufacturer1 Example: NIC COMPONENT; Manufacturer1 ComponentHeight: 0.55mm; HelpURL: \\cern.ch\dfs\Applications\Altium\Datasheets\R0603_NIC_NRC.pdf; Author: CERN DEM JLC; CreateDate: 03.12.2007; LatestRevisionDate: 13.03.2008
R58-R63 = R0603_2K7_1%_0.1W_100PPM: Resistor - 1%; Part Description: General Purpose Thick Film Chip Resistor; Manufacturer: GENERIC; Manufacturer1 Part Number: RC0603FR-072K7L; Power: 0.1W; TC: ±100ppm/°C; PressFit: No; Part Number: R0603_2K7_1%_0.1W_100PPM; Component Kind: Standard; Component Type: Standard; Pin Count: 2; Value: 2k7; Status: Preferred; Manufacturer Part Number: R0603_2K7_1%_0.1W_100PPM; Case: 0603; Mounted: Yes; Sense: No; Socket: No; SMD: Yes; Manufacturer1 Example: YAGEO PHYCOMP; Manufacturer1 ComponentHeight: 0.55mm; HelpURL: \\cern.ch\dfs\Applications\Altium\Datasheets\R0603_PHYCOMP_RC0603.pdf; Author: CERN DEM JLC; CreateDate: 02.05.2011; LatestRevisionDate: 02.05.2011
R78 R81-R85 R87 R88 = R0603_1K_1%_0.1W_100PPM: Resistor - 1%; Part Description: General Purpose Thick Film Chip Resistor; Manufacturer: GENERIC; Manufacturer1 Part Number: NRC06F1001TRF; Power: 0.1W; TC: ±100ppm/°C; PressFit: No; Part Number: R0603_1K_1%_0.1W_100PPM; Component Kind: Standard; Component Type: Standard; Pin Count: 2; Value: 1k; Status: Preferred; Manufacturer Part Number: R0603_1K_1%_0.1W_100PPM; Case: 0603; Mounted: Yes; Sense: No; Socket: No; SMD: Yes; Manufacturer1 Example: NIC COMPONENT; Manufacturer1 ComponentHeight: 0.55mm; HelpURL: \\cern.ch\dfs\Applications\Altium\Datasheets\R0603_NIC_NRC.pdf; Author: CERN DEM JLC; CreateDate: 03.12.2007; LatestRevisionDate: 13.03.2008
R86 = R0603_33R_1%_0.1W_100PPM: Resistor - 1%; Part Description: General Purpose Thick Film Chip Resistor; Manufacturer: GENERIC; Manufacturer1 Part Number: NRC06F33R0TRF; Power: 0.1W; TC: ±100ppm/°C; PressFit: No; Part Number: R0603_33R_1%_0.1W_100PPM; Component Kind: Standard; Component Type: Standard; Pin Count: 2; Value: 33; Status: Preferred; Manufacturer Part Number: R0603_33R_1%_0.1W_100PPM; Case: 0603; Mounted: Yes; Sense: No; Socket: No; SMD: Yes; Manufacturer1 Example: NIC COMPONENT; Manufacturer1 ComponentHeight: 0.55mm; HelpURL: \\cern.ch\dfs\Applications\Altium\Datasheets\R0603_NIC_NRC.pdf; Author: CERN DEM JLC; CreateDate: 03.12.2007; LatestRevisionDate: 13.03.2008
R90 R91 = R0603_100R_1%_0.1W_100PPM: Resistor - 1%; Part Description: General Purpose Thick Film Chip Resistor; Manufacturer: GENERIC; Manufacturer1 Part Number: NRC06F4700TRF; Power: 0.1W; TC: ±100ppm/°C; PressFit: No; Part Number: R0603_100R_1%_0.1W_100PPM; Component Kind: Standard; Component Type: Standard; Pin Count: 2; Value: 100; Status: Preferred; Manufacturer Part Number: R0603_100R_1%_0.1W_100PPM; Case: 0603; Mounted: Yes; Sense: No; Socket: No; SMD: Yes; Manufacturer1 Example: NIC COMPONENT; Manufacturer1 ComponentHeight: 0.55mm; HelpURL: \\cern.ch\dfs\Applications\Altium\Datasheets\R0603_NIC_NRC.pdf; Author: CERN DEM JLC; CreateDate: 03.12.2007; LatestRevisionDate: 13.03.2008
W1 = SAMTEC_MTLW-110-07-L-S-250: 10 Mini Wire-Wrap Contact Strip Header; Part Description: 10 Contacts, Pitch 2.54mm, Single Row Through Mount Straight Header (Post Lead = 6.35mm, Tail Lead 3.05mm, Insulator 1.52mm); Manufacturer: SAMTEC; PressFit: No; Part Number: SAMTEC_MTLW-110-07-L-S-250; Component Kind: Standard; Component Type: Standard; Pin Count: 10; Family: Header 10; Mounted: Yes; Socket: No; Sense: No; SMD: No; Status: None; Manufacturer Part Number: MTLW-110-07-L-S-250; ComponentHeight: 7.87mm; HelpURL: \\cern.ch\dfs\Applications\Altium\Datasheets\SAMTEC_MTLW-110-07-L-S-250.pdf; Author: CERN DEM JLC; CreateDate: 01.11.2017; LatestRevisionDate: 01.11.2017
W2 = SAMTEC_HTSW-104-23-L-S: 4 Mini Wire-Wrap Contact Strip Header; Part Description: 4 Contacts, Pitch 2.54mm, Single Row  Through Mount Straight Header (Post Lead 5.84mm, Tail Lead 2.92mm, Insulator 2.54mm); Manufacturer: SAMTEC; PressFit: No; Status Comment: High Temperature; Part Number: SAMTEC_HTSW-104-23-L-S; Component Kind: Standard; Component Type: Standard; Pin Count: 4; Family: Header 4; Mounted: Yes; Socket: No; Sense: No; SMD: No; Status: Preferred; Manufacturer Part Number: HTSW-104-23-L-S; ComponentHeight: 8.38mm; HelpURL: \\cern.ch\dfs\Applications\Altium\Datasheets\SAMTEC_HTSW-104-23-L-S.pdf; Author: CERN DEM JLC; CreateDate: 22.02.2018; LatestRevisionDate: 22.02.2018

## Sheet USB.SchDoc: Thermostat 8CH
size 420 x 297 mm; Author: G.Kasprowicz; CompanyName: WUT ISE; DrawnBy: G.Kasprowicz; Organization: WUT ISE; Address1: PW ISE; Address2: Nowowiejska 15/19 00-665 Warsaw; Address3: gkasprow@gmail.com; DocumentNumber: 8; Revision: 1.0; SheetNumber: 8; SheetTotal: 8; ModifiedBy: -; CheckedDate: -; Title2: USB connector; DivGrp: WUT ISE; Designer: G.Kasprowicz; ModifiedDate: -; ProjectName: Sensor Box
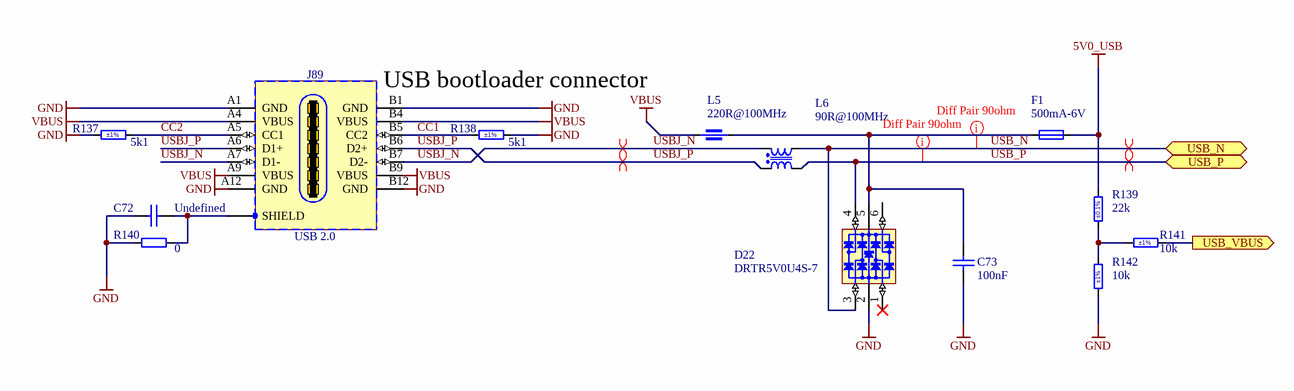
[diagram p2: USB.SchDoc]

### Parts
C72  Undefined  [CAPC2012X135N]
C73  100nF  [CAPC1608X87N]
D22  DRTR5V0U4S-7  [SOT65P210X110-6N]
F1  500mA-6V  [FUSR_BOURNS_MF-PSMF050]
J89  USB 2.0  [KYCON_KUSBX-SL-CS1N14-B]
L5  220R@100MHz  [INDC1608X95N]
L6  90R@100MHz  [IND_MURATA_DLW21S]
R137  5k1  Tolerance: ±1%  [RESC1608X55N]
R138  5k1  Tolerance: ±1%  [RESC1608X55N]
R139  22k  Tolerance: ±0.1%  [RESC1608X64N]
R140  0  [RESC1608X55N]
R141  10k  Tolerance: ±1%  [RESC1608X55N]
R142  10k  Tolerance: ±1%  [RESC1608X55N]

### Ports
USB_N (bidir), USB_P (bidir), USB_VBUS (out)

### Nets
5V0_USB: F1.1 R139.2
GND: C72.1 C73.1 D22.2(GND) J89.A1(GND) J89.A12(GND) J89.B1(GND) J89.B12(GND) R137.1 R138.2 R140.2 R142.1
VBUS: J89.A4(VBUS) J89.A9(VBUS) J89.B4(VBUS) J89.B9(VBUS) L5.2
CC1: J89.B5(CC2) R138.1
CC2: J89.A5(CC1) R137.2
USB_N: D22.3(I/O2) L6.2 ; port USB_N
USB_P: D22.4(I/O3) L6.3 ; port USB_P
USB_VBUS: R141.2 ; port USB_VBUS
USBJ_N: J89.A7(D1-) J89.B7(D2-) L6.1
USBJ_P: J89.A6(D1+) J89.B6(D2+) L6.4
NetC72_2: C72.2 J89.SHIELD R140.1
NetC73_2: C73.2 D22.5(VBUS) F1.2 L5.1
NetR139_1: R139.1 R141.1 R142.2

Not connected (* = marked no-connect by the designer): D22 1(I/O1)* 6(I/O4)

### Layout directives
mark named Diff Pair 90ohm: USB_N, USB_P
differential pair: USB_N, USB_P, USBJ_N, USBJ_P

### Notes on the sheet
- (near J89) USB bootloader connector
- Project/Equipment
- Document
- Designer
- Drawn by
- Check.by
- Copyright WUT ISE 2020.
  This documentation describes Open Hardware and is licensed under the CERN OHL v.1.2. You may redistribute and modify this documentation under the terms of the CERN OHL v.1.2. (http://ohwr.org/CERNOHL). This documentation is distributed WITHOUT ANY EXPRESS OR IMPLIED WARRANTY, INCLUDING OF MERCHANTABILITY, SATISFACTORY QUALITY AND FITNESS FOR A PARTICULAR PURPOSE. Please see the CERN OHL v.1.2 for applicable conditions.
- Contact
- File
- Last Mod.
- Print Date
- Sheet
- Size
- A3
- of
- Rev

### Library data of the parts
C72 = CC0805_NO-VALUE: as C67 on sheet Thermostat_16CH; Part Number: CC0805_NO-VALUE; Component Kind: Standard; Component Type: Standard; Pin Count: 2; Value: Undefined; Status: None; Manufacturer: Undefined; Manufacturer Part Number: CC0805_NO-VALUE; Case: 0805; Socket: No; SMD: Yes; Sense: No; Manufacturer1 ComponentHeight: 1.35mm; HelpURL: Undefined; Author: CERN DEM JLC; CreateDate: 10.12.2008; LatestRevisionDate: 11.09.2013
C73 = CC0603_100NF_50V_10%_X7R: as C70 on sheet Thermostat_16CH; Part Number: CC0603_100NF_50V_10%_X7R; Component Kind: Standard; Component Type: Standard; Pin Count: 2; Value: 100nF; Status: Preferred; Manufacturer Part Number: CC0603_100NF_50V_10%_X7R; Case: 0603; Mounted: Yes; Socket: No; SMD: Yes; Sense: No; Manufacturer1 Example: PHYCOMP; Manufacturer1 ComponentHeight: 0.87mm; HelpURL: \\cern.ch\dfs\Applications\Altium\Datasheets\CC0603_X7R_PHYCOMP.pdf; Author: CERN DEM JLC; CreateDate: 03.12.2007; LatestRevisionDate: 03.12.2007
D22 = D_TVS_DRTR5V0U4S-7: as D21 on sheet Thermostat_16CH; Part Number: DRTR5V0U4S-7; Component Kind: Standard; Component Type: Standard; Device: DRTR5V0U4S-7; PackageDescription: SOT363, SC70-6, 0.65mm Pitch; 6 Pin, 1.25mm W X 2.00mm L X 1.10mm H body, IPC Medium Density; Status: Active; Manufacturer Part Number: DRTR5V0U4S-7; Pin Count: 6; Case: SOT363; Mounted: Yes; Socket: No; SMD: Yes; Sense: No; ComponentHeight: 1.1mm; HelpURL: \\cern.ch\dfs\Applications\Altium\Datasheets\PRTR5V0U4Y.pdf; Author: GK; CreateDate: 24.01.2017; LatestRevisionDate: 14.09.2020
F1 = FUSR_BOURNS_MF-PSMF050X-2: Fuse; Part Description: PTC Resettable Fuse; Manufacturer: BOURNS; PressFit: No; Part Number: FUSR_BOURNS_MF-PSMF050X-2; Component Kind: Standard; Component Type: Standard; Pin Count: 2; PackageDescription: PTC Resettable Fuse, MF-PSMS Series, Height 0.48mm; Family: Fuses Resettable; Mounted: Yes; Socket: No; SMD: Yes; Sense: No; Value: 500mA-6V; Manufacturer Part Number: MF-PSMF050X-2; ComponentHeight: 0.48mm; HelpURL: \\cern.ch\dfs\Applications\Altium\Datasheets\FUSR_BOURNS_MF-PSMF.pdf; Author: CERN DEM MR; CreateDate: 02.12.2015; LatestRevisionDate: 02.12.2015
J89 = KYCON_KUSBX-SL-CS1N14-B: 2x7 Pin + 1 Shield  USB Type C Receptacle; Part Description: USB 2.0 Type C Receptacle, High Temp., Flag Style Through Hole 14 Pin, Black; Manufacturer: KYCON; PressFit: No; Part Number: KYCON_KUSBX-SL-CS1N14-B; Component Kind: Standard; Component Type: Standard; Pin Count: 18; Family: USB 2.0; Mounted: Yes; Socket: No; SMD: No; Sense: No; Status: None; Manufacturer Part Number: KUSBX-SL-CS1N14-B; ComponentHeight: 8.34mm; HelpURL: \\cern.ch\dfs\Applications\Altium\Datasheets\KYCON_KUSBX-SL-CS1N14-B.pdf; Author: CERN DEM BC; CreateDate: 03.11.2020; LatestRevisionDate: 03.11.2020
L5 = IND0603_MURATA_BLM18SG221TN1: as L1 on sheet MCU_STM32F4; Part Number: IND0603_MURATA_BLM18SG221TN1; Component Kind: Standard; Component Type: Standard; Pin Count: 2; Value: 220R@100MHz; Manufacturer Part Number: BLM18SG221TN1; Case: 0603; Mounted: Yes; Socket: No; SMD: Yes; Sense: No; ComponentHeight: 0.95mm; HelpURL: \\cern.ch\dfs\Applications\Altium\Datasheets\IND0603_MURATA_BLM18S.pdf; Author: CERN DEM MR; CreateDate: 08.01.2016; LatestRevisionDate: 25.10.2018
L6 = IND_MURATA_DLW21SN900SQ2L: Inductor Common Mode; Part Description: Wire Wound Common Mode Choke Coil (DLW21S Series); Manufacturer: MURATA; Power: 330mA; Resistance: 0.35R; Tolerance: ±25%; Part Number: IND_MURATA_DLW21SN900SQ2L; Component Kind: Standard; Component Type: Standard; Pin Count: 4; Value: 90R@100MHz; Manufacturer Part Number: DLW21SN900SQ2L; Case: 0805; Mounted: Yes; Socket: No; SMD: Yes; Sense: No; ComponentHeight: 1.4mm; HelpURL: \\cern.ch\dfs\Applications\Altium\Datasheets\IND_MURATA_DLW21S.pdf; Author: CERN DEM JLC; CreateDate: 01.07.2014; LatestRevisionDate: 01.07.2014
R137 R138 = R0603_5K1_1%_0.1W_100PPM: Resistor - 1%; Part Description: General Purpose Thick Film Chip Resistor; Manufacturer: GENERIC; Manufacturer1 Part Number: NRC06F5101TRF; Power: 0.1W; TC: ±100ppm/°C; PressFit: No; Part Number: R0603_5K1_1%_0.1W_100PPM; Component Kind: Standard; Component Type: Standard; Pin Count: 2; Value: 5k1; Status: Preferred; Manufacturer Part Number: R0603_5K1_1%_0.1W_100PPM; Case: 0603; Mounted: Yes; Sense: No; Socket: No; SMD: Yes; Manufacturer1 Example: NIC COMPONENT; Manufacturer1 ComponentHeight: 0.55mm; HelpURL: \\cern.ch\dfs\Applications\Altium\Datasheets\R0603_NIC_NRC.pdf; Author: CERN DEM JLC; CreateDate: 03.12.2007; LatestRevisionDate: 13.03.2008
R139 = R0603_22K_0.1%_0.1W_25PPM: Resistor - 0.1%; Part Description: Thin Film Chip Resistor; Manufacturer: GENERIC; Manufacturer1 Part Number: ERA-3AEB223V; Power: 0.1W; TC: ±25ppm/°C; PressFit: No; Part Number: R0603_22K_0.1%_0.1W_25PPM; Component Kind: Standard; Component Type: Standard; Pin Count: 2; Value: 22k; Status: Not Recommended; Manufacturer Part Number: R0603_22K_0.1%_0.1W_25PPM; Case: 0603; Mounted: Yes; Sense: No; Socket: No; SMD: Yes; Manufacturer1 Example: PANASONIC; Manufacturer1 ComponentHeight: 0.55mm; HelpURL: \\cern.ch\dfs\Applications\Altium\Datasheets\R0603_PANASONIC_ERA.pdf; Author: CERN DEM HF; CreateDate: 18.10.2023; LatestRevisionDate: 18.10.2023
R140 = R0603_0R_JUMPER: as R120 on sheet Thermostat_16CH; Part Number: R0603_0R_JUMPER; Component Kind: Standard; Component Type: Standard; Pin Count: 2; Value: 0; Status: Preferred; Manufacturer Part Number: R0603_0R_JUMPER; Case: 0603; Mounted: Yes; Sense: No; Socket: No; SMD: Yes; Manufacturer1 Example: NIC COMPONENT; Manufacturer1 ComponentHeight: 0.55mm; HelpURL: \\cern.ch\dfs\Applications\Altium\Datasheets\R0603_NIC_NRC.pdf; Author: CERN DEM JLC; CreateDate: 03.12.2007; LatestRevisionDate: 13.03.2008
R141 R142 = R0603_10K_1%_0.1W_100PPM: as R56 on sheet MCU_STM32F4; Part Number: R0603_10K_1%_0.1W_100PPM; Component Kind: Standard; Component Type: Standard; Pin Count: 2; Value: 10k; Status: Preferred; Manufacturer Part Number: R0603_10K_1%_0.1W_100PPM; Case: 0603; Mounted: Yes; Sense: No; Socket: No; SMD: Yes; Manufacturer1 Example: NIC COMPONENT; Manufacturer1 ComponentHeight: 0.55mm; HelpURL: \\cern.ch\dfs\Applications\Altium\Datasheets\R0603_NIC_NRC.pdf; Author: CERN DEM JLC; CreateDate: 03.12.2007; LatestRevisionDate: 13.03.2008